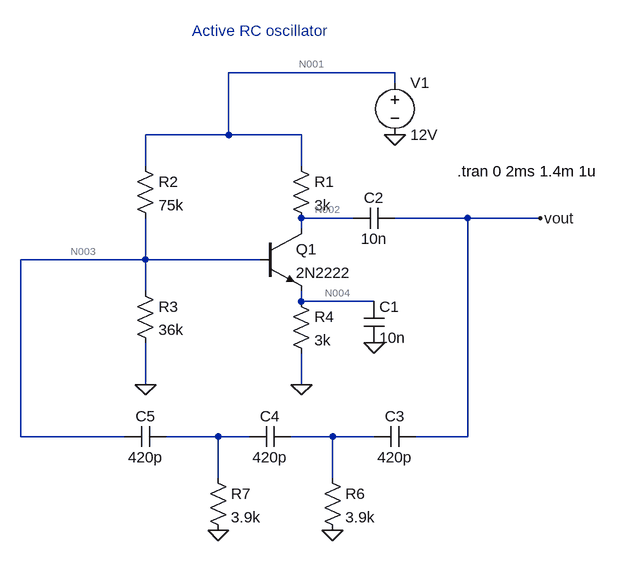
[diagram p0: schematic bjt_RC_oscillator.asc]
bjt_RC_oscillator.asc, the LTspice schematic file:
Version 4.1
SHEET 1 880 680
WIRE 288 -80 32 -80
WIRE 288 -64 288 -80
WIRE 32 16 32 -80
WIRE 32 16 -96 16
WIRE 144 16 32 16
WIRE -96 64 -96 16
WIRE 144 64 144 16
WIRE 224 144 144 144
WIRE 400 144 288 144
WIRE 512 144 400 144
WIRE 144 160 144 144
WIRE -96 208 -96 144
WIRE -96 208 -288 208
WIRE 80 208 -96 208
WIRE -96 256 -96 208
WIRE 144 272 144 256
WIRE 256 272 144 272
WIRE -96 400 -96 336
WIRE 144 400 144 352
WIRE -288 480 -288 208
WIRE -128 480 -288 480
WIRE 16 480 -64 480
WIRE 64 480 16 480
WIRE 192 480 128 480
WIRE 256 480 192 480
WIRE 400 480 400 144
WIRE 400 480 320 480
WIRE 16 544 16 480
WIRE 192 544 192 480
FLAG 512 144 vout
FLAG 256 336 0
FLAG -96 400 0
FLAG 144 400 0
FLAG 16 624 0
FLAG 192 624 0
FLAG 288 16 0
SYMBOL voltage 288 -80 R0
WINDOW 123 0 0 Left 0
WINDOW 39 0 0 Left 0
SYMATTR InstName V1
SYMATTR Value 12V
SYMBOL res 128 48 R0
SYMATTR InstName R1
SYMATTR Value 3k
SYMBOL res -112 48 R0
SYMATTR InstName R2
SYMATTR Value 75k
SYMBOL res -112 240 R0
SYMATTR InstName R3
SYMATTR Value 36k
SYMBOL res 128 256 R0
SYMATTR InstName R4
SYMATTR Value 3k
SYMBOL npn 80 160 R0
SYMATTR InstName Q1
SYMATTR Value 2N2222
SYMBOL cap 240 272 R0
SYMATTR InstName C1
SYMATTR Value 10n
SYMBOL cap 288 128 R90
WINDOW 0 0 32 VBottom 2
WINDOW 3 32 32 VTop 2
SYMATTR InstName C2
SYMATTR Value 10n
SYMBOL cap 320 464 R90
WINDOW 0 0 32 VBottom 2
WINDOW 3 32 32 VTop 2
SYMATTR InstName C3
SYMATTR Value 420p
SYMBOL cap 128 464 R90
WINDOW 0 0 32 VBottom 2
WINDOW 3 32 32 VTop 2
SYMATTR InstName C4
SYMATTR Value 420p
SYMBOL cap -64 464 R90
WINDOW 0 0 32 VBottom 2
WINDOW 3 32 32 VTop 2
SYMATTR InstName C5
SYMATTR Value 420p
SYMBOL res 176 528 R0
SYMATTR InstName R6
SYMATTR Value 3.9k
SYMBOL res 0 528 R0
SYMATTR InstName R7
SYMATTR Value 3.9k
TEXT 384 72 Left 2 !.tran 0 2ms 1.4m 1u
TEXT -24 -144 Left 2 ;Active RC oscillator

The netlist it stands for:
* bjt_RC_oscillator.asc
V1 N001 0 12V
R1 N001 N002 3k
R2 N001 N003 75k
R3 N003 0 36k
R4 N004 0 3k
Q1 N002 N003 N004 0 2N2222
C1 N004 0 10n
C2 vout N002 10n
C3 vout N006 420p
C4 N006 N005 420p
C5 N005 N003 420p
R6 N006 0 3.9k
R7 N005 0 3.9k
.model NPN NPN
.model PNP PNP
.lib standard.bjt
.tran 0 2ms 1.4m 1u
* Active RC oscillator
.backanno
.end

* Results of the author's LTspice run, read from the files saved beside the schematic
* Operating Point, zero values left out:
*   V(n002) = 8.898 V
*   V(n004) = 3.117 V
*   V(vout) = 88.98 nV
*   V(n001) = 12 V
*   V(n003) = 3.772 V
*   I(V1) = -1.144 mA
*   I(R2) = 109.7 µA
*   I(R4) = 1.039 mA
*   Ic(Q1) = 1.034 mA
*   Ib(Q1) = 4.934 µA
*   Ie(Q1) = -1.039 mA
*   I(R3) = 104.8 µA
*   I(R1) = 1.034 mA